# Altium schematic sheet Block_Diagram.SchDoc
size B; Organization: ORGANIZATION; Address1: ADDRESS 1; Address2: ADDRESS 2; Address3: ADDRESS 3; Address4: ADDRESS 4; Revision: -; SheetNumber: 1; SheetTotal: 7; ENG_APP_DATE: --/--/--; DSN_APP_DATE: --/--/--; CHK_APP_DATE: --/--/--
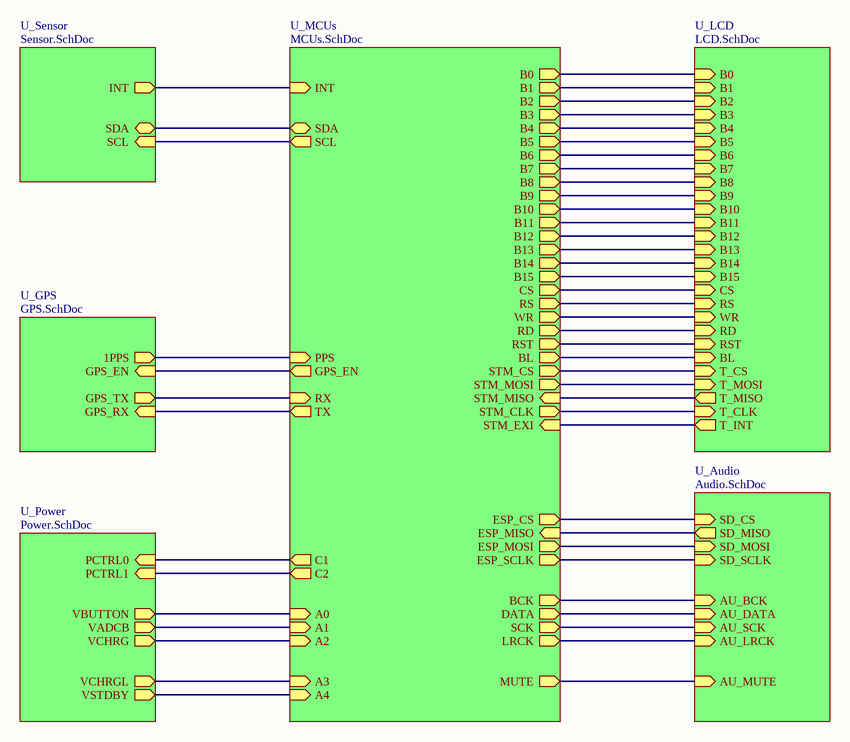
[diagram p0: Block_Diagram.SchDoc]

## Sub-sheets
U_Audio = Audio.SchDoc: AU_LRCK (in), SD_MISO (out), SD_CS (in), AU_DATA (in), AU_BCK (in), SD_SCLK (in), AU_SCK (in), AU_MUTE (in), SD_MOSI (in)
U_GPS = GPS.SchDoc: 1PPS (out), GPS_EN (in), GPS_TX (out), GPS_RX (in)
U_LCD = LCD.SchDoc: RST (in), B14 (in), B15 (in), RS (in), B7 (in), B9 (in), B5 (in), CS (in), T_CS (in), T_INT (out), T_MISO (out), B13 (in), B3 (in), B1 (in), T_MOSI (in), RD (in), B0 (in), B2 (in), B4 (in), B6 (in), BL (in), WR (in), B11 (in), T_CLK (in), B12 (in), B10 (in), B8 (in)
U_MCUs = MCUs.SchDoc: B11 (out), A4 (in), B8 (out), B5 (out), B7 (out), B4 (out), B10 (out), A0 (in), A2 (in), B13 (out), B1 (out), B15 (out), A1 (in), B0 (out), B6 (out), B9 (out), A3 (in), B12 (out), B14 (out), B2 (out), B3 (out), SCL (out), C1 (out), RX (in), SDA (bidir), C2 (out), TX (out), RST (out), WR (out), RD (out), CS (out), STM_EXI (in), STM_MISO (in), STM_CS (out), STM_CLK (out), STM_MOSI (out), BL (out), RS (out), PPS (in), ESP_CS (out), ESP_MOSI (out), BCK (out), LRCK (out), SCK (out), DATA (out), ESP_MISO (in), ESP_SCLK (out), INT (in), MUTE (out), GPS_EN (out)
U_Power = Power.SchDoc: VBUTTON (out), VCHRG (out), PCTRL1 (in), PCTRL0 (in), VADCB (out), VSTDBY (out), VCHRGL (out)
U_Sensor = Sensor.SchDoc: SCL (in), INT (out), SDA (bidir)

## Nets
(unnamed): sheet U_MCUs/B11, sheet U_LCD/B11
(unnamed): sheet U_MCUs/A4, sheet U_Power/VSTDBY
(unnamed): sheet U_MCUs/B8, sheet U_LCD/B8
(unnamed): sheet U_MCUs/B5, sheet U_LCD/B5
(unnamed): sheet U_MCUs/B7, sheet U_LCD/B7
(unnamed): sheet U_MCUs/B4, sheet U_LCD/B4
(unnamed): sheet U_MCUs/B10, sheet U_LCD/B10
(unnamed): sheet U_MCUs/A0, sheet U_Power/VBUTTON
(unnamed): sheet U_MCUs/A2, sheet U_Power/VCHRG
(unnamed): sheet U_MCUs/B13, sheet U_LCD/B13
(unnamed): sheet U_MCUs/B1, sheet U_LCD/B1
(unnamed): sheet U_MCUs/B15, sheet U_LCD/B15
(unnamed): sheet U_MCUs/A1, sheet U_Power/VADCB
(unnamed): sheet U_MCUs/B0, sheet U_LCD/B0
(unnamed): sheet U_MCUs/B6, sheet U_LCD/B6
(unnamed): sheet U_MCUs/B9, sheet U_LCD/B9
(unnamed): sheet U_MCUs/A3, sheet U_Power/VCHRGL
(unnamed): sheet U_MCUs/B12, sheet U_LCD/B12
(unnamed): sheet U_MCUs/B14, sheet U_LCD/B14
(unnamed): sheet U_MCUs/B2, sheet U_LCD/B2
(unnamed): sheet U_MCUs/B3, sheet U_LCD/B3
(unnamed): sheet U_MCUs/SCL, sheet U_Sensor/SCL
(unnamed): sheet U_MCUs/C1, sheet U_Power/PCTRL0
(unnamed): sheet U_MCUs/RX, sheet U_GPS/GPS_TX
(unnamed): sheet U_MCUs/SDA, sheet U_Sensor/SDA
(unnamed): sheet U_MCUs/C2, sheet U_Power/PCTRL1
(unnamed): sheet U_MCUs/TX, sheet U_GPS/GPS_RX
(unnamed): sheet U_MCUs/RST, sheet U_LCD/RST
(unnamed): sheet U_MCUs/WR, sheet U_LCD/WR
(unnamed): sheet U_MCUs/RD, sheet U_LCD/RD
(unnamed): sheet U_MCUs/CS, sheet U_LCD/CS
(unnamed): sheet U_MCUs/STM_EXI, sheet U_LCD/T_INT
(unnamed): sheet U_MCUs/STM_MISO, sheet U_LCD/T_MISO
(unnamed): sheet U_MCUs/STM_CS, sheet U_LCD/T_CS
(unnamed): sheet U_MCUs/STM_CLK, sheet U_LCD/T_CLK
(unnamed): sheet U_MCUs/STM_MOSI, sheet U_LCD/T_MOSI
(unnamed): sheet U_MCUs/BL, sheet U_LCD/BL
(unnamed): sheet U_MCUs/RS, sheet U_LCD/RS
(unnamed): sheet U_MCUs/PPS, sheet U_GPS/1PPS
(unnamed): sheet U_MCUs/ESP_CS, sheet U_Audio/SD_CS
(unnamed): sheet U_MCUs/ESP_MOSI, sheet U_Audio/SD_MOSI
(unnamed): sheet U_MCUs/BCK, sheet U_Audio/AU_BCK
(unnamed): sheet U_MCUs/LRCK, sheet U_Audio/AU_LRCK
(unnamed): sheet U_MCUs/SCK, sheet U_Audio/AU_SCK
(unnamed): sheet U_MCUs/DATA, sheet U_Audio/AU_DATA
(unnamed): sheet U_MCUs/ESP_MISO, sheet U_Audio/SD_MISO
(unnamed): sheet U_MCUs/ESP_SCLK, sheet U_Audio/SD_SCLK
(unnamed): sheet U_MCUs/INT, sheet U_Sensor/INT
(unnamed): sheet U_MCUs/MUTE, sheet U_Audio/AU_MUTE
(unnamed): sheet U_MCUs/GPS_EN, sheet U_GPS/GPS_EN

## Notes on the sheet
- DWG. NO.
- REV.
- SHT.
- THIS DOCUMENT AND THE DATA DISCLOSED HEREIN OR HEREWITH IS THE PROPERTY OF ALTIUM LIMITED AND MAY BE FREELY DISTRIBUTED IN WHOLE. NO RIGHTS ARE RESERVED OR EXPRESS OR IMPLIED WARANTEE GIVEN.
- REVISION
- DESCRIPTION
- DATE
- APPROVED
- ENG:
- APPROVALS
- PROJECT
- DSN:
- CHK:
- REFERENCE DOCUMENTS
- PROJECT REVISION:
- TITLE
- DOCUMENT REVISION:
- DESIGN ITEM:
- BOM:
- FAB DWG:
- PCB DWG:
- ASSY DWG:
- SCALE:
- SIZE
- B
- CAGE CODE
- FILE NAME
- DWG NO.
- SHEET
- OF
- REV